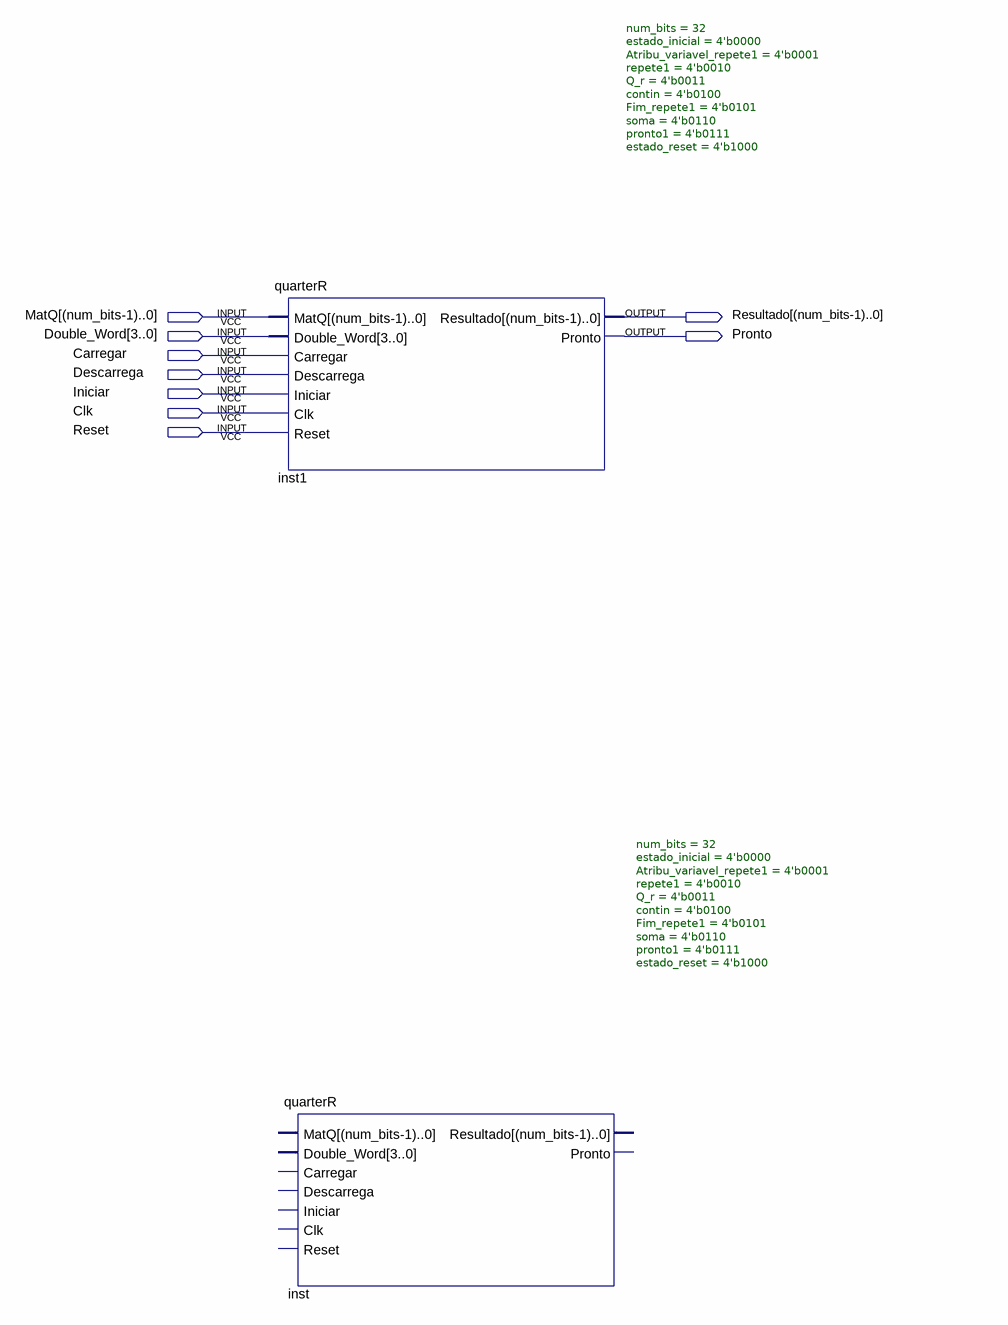
[diagram p0: schematic sheet]
// Quartus schematic QUARTERROUND.bdf as structural Verilog: 2 symbols, 9 pins
module QUARTERROUND (
  input  \MatQ[(num_bits-1)..0] ,
  input  [3:0] Double_Word,
  input  Carregar,
  input  Descarrega,
  input  Iniciar,
  input  Clk,
  input  Reset,
  output \Resultado[(num_bits-1)..0] ,
  output Pronto
);

  quarterR #(.num_bits(32), .estado_inicial(4'b0000), .Atribu_variavel_repete1(4'b0001), .repete1(4'b0010), .Q_r(4'b0011), .contin(4'b0100), .Fim_repete1(4'b0101), .soma(4'b0110), .pronto1(4'b0111), .estado_reset(4'b1000)) inst1 (
    .MatQ({32{\MatQ[(num_bits-1)..0] }}), .Double_Word(Double_Word), .Carregar(Carregar),
    .Descarrega(Descarrega), .Iniciar(Iniciar), .Clk(Clk), .Reset(Reset),
    .Resultado(\Resultado[(num_bits-1)..0] ), .Pronto(Pronto));
  quarterR #(.num_bits(32), .estado_inicial(4'b0000), .Atribu_variavel_repete1(4'b0001), .repete1(4'b0010), .Q_r(4'b0011), .contin(4'b0100), .Fim_repete1(4'b0101), .soma(4'b0110), .pronto1(4'b0111), .estado_reset(4'b1000)) inst ();  // open: MatQ, Double_Word, Carregar, Descarrega, Iniciar, Clk, Reset, Resultado, Pronto
endmodule
